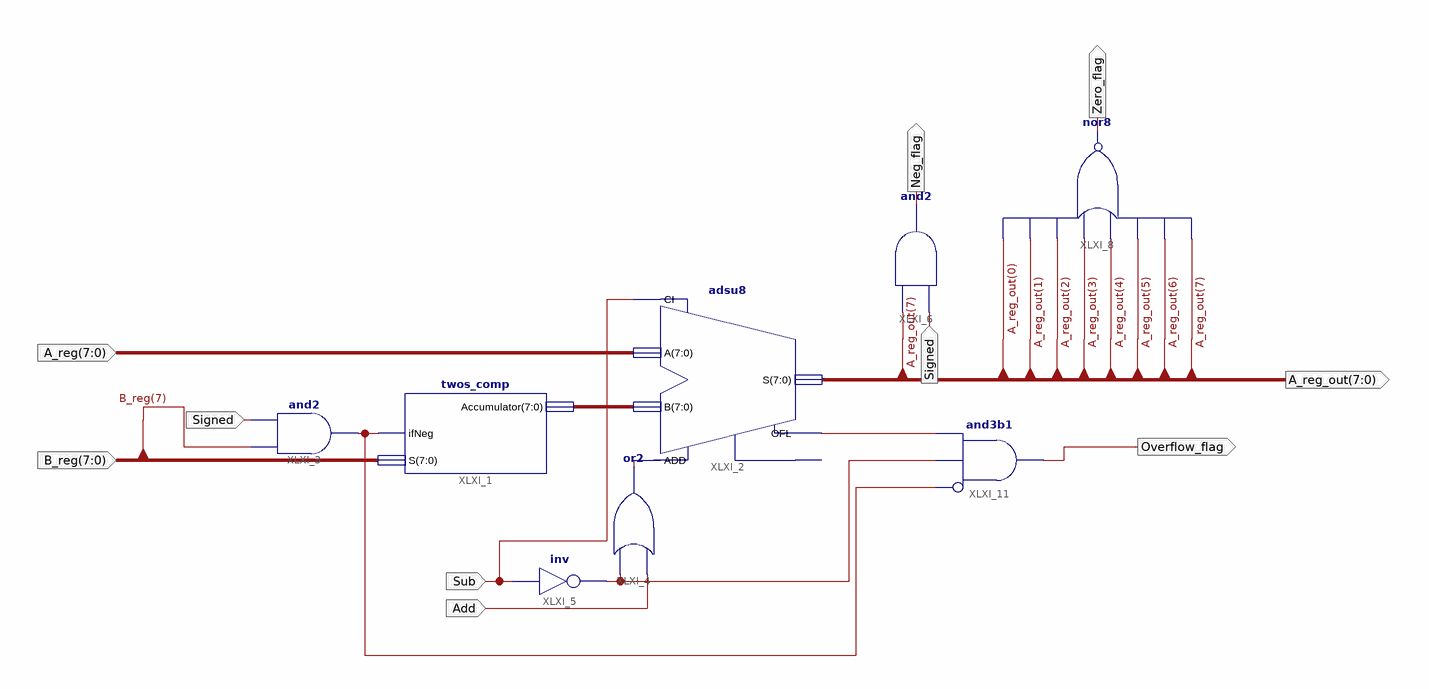
[diagram p0: schematic sheet 1]
// Xilinx ISE schematic ALU_v4.sch (spartan3e) as structural Verilog: 8 symbols, 9 ports
module ALU_v4 (
  input  [7:0] B_reg,
  input  [7:0] A_reg,
  input  Signed,
  input  Sub,
  input  Add,
  output [7:0] A_reg_out,
  output Neg_flag,
  output Zero_flag,
  output Overflow_flag
);

  wire XLXN_4, XLXN_7, XLXN_8, XLXN_26;
  wire [7:0] XLXN_1;

  twos_comp XLXI_1 (.S(B_reg), .ifNeg(XLXN_4), .Accumulator(XLXN_1));
  adsu8 XLXI_2 (.A(A_reg), .ADD(XLXN_7), .B(XLXN_1), .CI(Sub), .OFL(XLXN_26), .S(A_reg_out));  // open: CO
  and XLXI_3 (XLXN_4, B_reg[7], Signed);
  or XLXI_4 (XLXN_7, Add, XLXN_8);
  not XLXI_5 (XLXN_8, Sub);
  and XLXI_6 (Neg_flag, Signed, A_reg_out[7]);
  nor XLXI_8 (Zero_flag, A_reg_out[7], A_reg_out[6], A_reg_out[5], A_reg_out[4], A_reg_out[3], A_reg_out[2], A_reg_out[1], A_reg_out[0]);
  and XLXI_11 (Overflow_flag, ~XLXN_4, XLXN_8, XLXN_26);  // and3b1
endmodule
